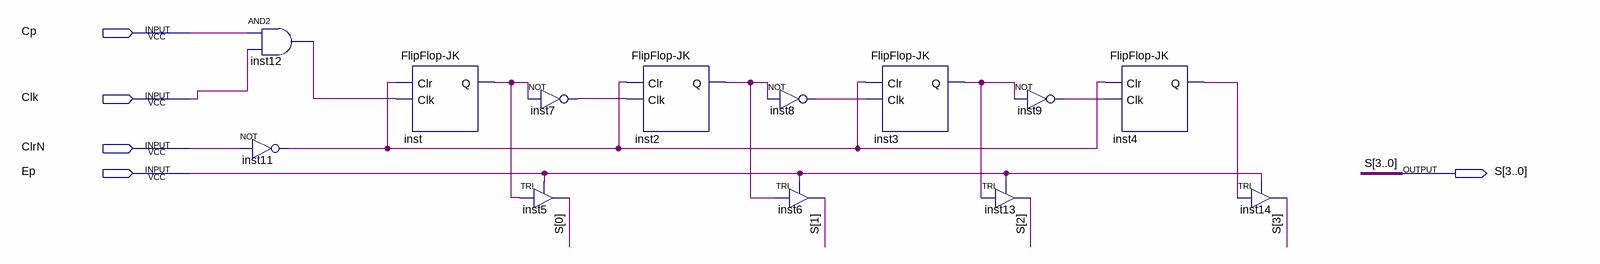
[diagram p0: schematic sheet]
// Quartus schematic Contador-Programa.bdf as structural Verilog: 13 symbols, 5 pins
module \Contador-Programa  (
  input  Cp,
  input  Clk,
  input  ClrN,
  input  Ep,
  output [3:0] S
);

  wire inst2_q, inst3_q, inst4_q, inst7_out, inst8_out, inst9_out, inst11_out, inst12_out, inst_q;

  not inst11 (inst11_out, ClrN);
  and inst12 (inst12_out, Cp, Clk);
  \FlipFlop-JK  inst (.Clr(inst11_out), .Clk(inst12_out), .Q(inst_q));
  not inst7 (inst7_out, inst_q);
  TRI inst5 (.IN(inst_q), .OE(Ep), .OUT(S[0]));
  \FlipFlop-JK  inst2 (.Clr(inst11_out), .Clk(inst7_out), .Q(inst2_q));
  not inst8 (inst8_out, inst2_q);
  TRI inst6 (.IN(inst2_q), .OE(Ep), .OUT(S[1]));
  \FlipFlop-JK  inst3 (.Clr(inst11_out), .Clk(inst8_out), .Q(inst3_q));
  not inst9 (inst9_out, inst3_q);
  TRI inst13 (.IN(inst3_q), .OE(Ep), .OUT(S[2]));
  \FlipFlop-JK  inst4 (.Clr(inst11_out), .Clk(inst9_out), .Q(inst4_q));
  TRI inst14 (.IN(inst4_q), .OE(Ep), .OUT(S[3]));
endmodule
